# Altium schematic sheet w5500.SchDoc
size A4
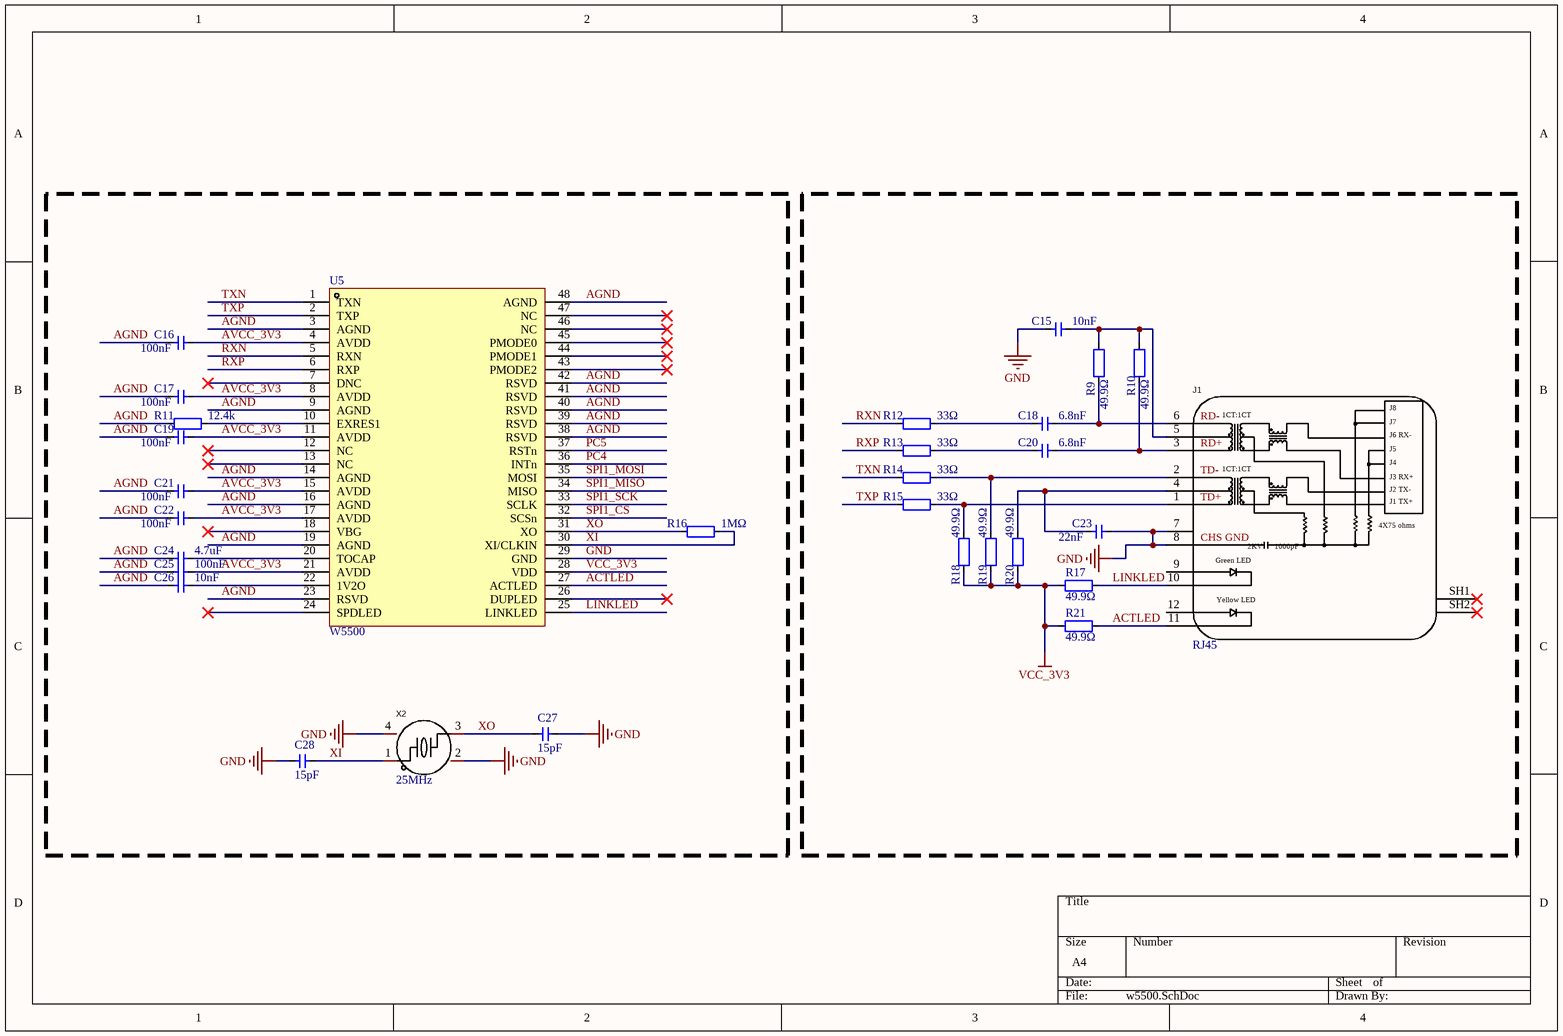
[diagram p0: w5500.SchDoc]

## Parts
C15  10nF  [C0603]
C16  100nF  [C0603]
C17  100nF  [C0603]
C18  6.8nF  [C0603]
C19  100nF  [C0603]
C20  6.8nF  [C0603]
C21  100nF  [C0603]
C22  100nF  [C0603]
C23  22nF  [C0603]
C24  4.7uF  [C0603]
C25  100nF  [C0603]
C26  10nF  [C0603]
C27  15pF  [C0603]
C28  15pF  [C0603]
J1  RJ45  [RJ45-TH_HR911105A]
R9  49.9Ω  [R0603]
R10  49.9Ω  [R0603]
R11  12.4k  [R0603]
R12  33Ω  [R0603]
R13  33Ω  [R0603]
R14  33Ω  [R0603]
R15  33Ω  [R0603]
R16  1MΩ  [R0603]
R17  49.9Ω  [R0603]
R18  49.9Ω  [R0603]
R19  49.9Ω  [R0603]
R20  49.9Ω  [R0603]
R21  49.9Ω  [R0603]
U5  W5500  [LQFP-48_L7.0-W7.0-P0.50-LS9.0-BL]
X2  25MHz  [CRYSTAL-SMD_4P-L3.2-W2.5-BL-1]

## Nets
GND: C15.1 C23.2 C27.2 C28.1 J1.7 J1.8 U5.29(GND) X2.2(GND) X2.4(GND)
VCC_3V3: R17.2 R18.2 R19.2 R20.2 R21.2 U5.28(VDD)
ACTLED: J1.11 R21.1 U5.27(ACTLED)
AGND: C16.1 C17.1 C19.1 C21.1 C22.1 C24.1 C25.1 C26.1 R11.1 U5.3(AGND) U5.9(AGND) U5.14(AGND) U5.16(AGND) U5.19(AGND) U5.23(RSVD) U5.38(RSVD) U5.39(RSVD) U5.40(RSVD) U5.41(RSVD) U5.42(RSVD) U5.48(AGND)
AVCC_3V3: C16.2 C17.2 C19.2 C21.2 C22.2 C25.2 U5.4(AVDD) U5.8(AVDD) U5.11(AVDD) U5.15(AVDD) U5.17(AVDD) U5.21(AVDD)
LINKLED: J1.10 R17.1 U5.25(LINKLED)
PC4: U5.36(INTn)
PC5: U5.37(RSTn)
RXN: R12.1 U5.5(RXN)
RXP: R13.1 U5.6(RXP)
SPI1_CS: U5.32(SCSn)
SPI1_MISO: U5.34(MISO)
SPI1_MOSI: U5.35(MOSI)
SPI1_SCK: U5.33(SCLK)
TXN: R14.1 U5.1(TXN)
TXP: R15.1 U5.2(TXP)
XI: C28.2 R16.2 U5.30(XI/CLKIN) X2.1
XO: C27.1 R16.1 U5.31(XO) X2.3
NetC15_2: C15.2 J1.5 R9.2 R10.2
NetC18_1: C18.1 R12.2
NetC18_2: C18.2 J1.6 R9.1
NetC20_1: C20.1 R13.2
NetC20_2: C20.2 J1.3 R10.1
NetC23_1: C23.1 J1.4 R20.1
NetC24_2: C24.2 U5.20(TOCAP)
NetC26_2: C26.2 U5.22(1V2O)
NetJ1_1: J1.1 R15.2 R18.1
NetJ1_2: J1.2 R14.2 R19.1
NetR11_2: R11.2 U5.10(EXRES1)

Not connected (* = marked no-connect by the designer): J1 9 12 SH1* SH2*; U5 7(DNC)* 12(NC)* 13(NC)* 18(VBG)* 24(SPDLED)* 26(DUPLED)* 43(PMODE2)* 44(PMODE1)* 45(PMODE0)* 46(NC)* 47(NC)*

## Notes on the sheet
- (in symbol RJ45) J8; RD-; 1CT:1CT; J7; J6 RX-; RD+; J5; J4; TD-; J3 RX+; J2 TX-; TD+; J1 TX+; 4X75 ohms; CHS GND; 2KV; 1000pF; Green LED; Yellow LED

## Library data of the parts
C15-C28 = C0603
J1 = RJ45: Manufacturer: HANRUN(汉仁); Name: HR911105A; Symbol: HR911105A_C12074; Add into BOM: yes; Connector Type: RJ插座; Number of Ports: 1; LED: 带LED; Device: HR911105A_C12074; LCSC Part Name: RJ45 带LED 带LED灯; Supplier Part: C12074; Manufacturer Part: HR911105A; Supplier Footprint: 插件; JLCPCB Part Class: Extended Part; Datasheet: https://atta.szlcsc.com/upload/public/pdf/source/20170918/C12074_1505726819496976146.pdf; Supplier: LCSC; Convert to PCB: yes; USOC Codes: RJ45; Ratings: -; Shielding: -
R9-R21 = R0603
X2 = 8Mhz: Manufacturer: CJ(江苏长电/长晶); Symbol: CJ13-080001210C30; Add into BOM: yes; Value: 8MHz; Load Capacitance: 12pF; Name: 8MHz; Device: CJ13-080001210C30; LCSC Part Name: 8MHz 12pF; Supplier Part: C2875275; Manufacturer Part: CJ13-080001210C30; Supplier Footprint: SMD3225-4P; JLCPCB Part Class: Extended Part; Datasheet: https://atta.szlcsc.com/upload/public/pdf/source/20211013/0FAD337EB33B5BE9D660099A731DCCD1.pdf; Supplier: LCSC; Convert to PCB: yes